# EAGLE schematic schematic (EAGLE 7.1.0)
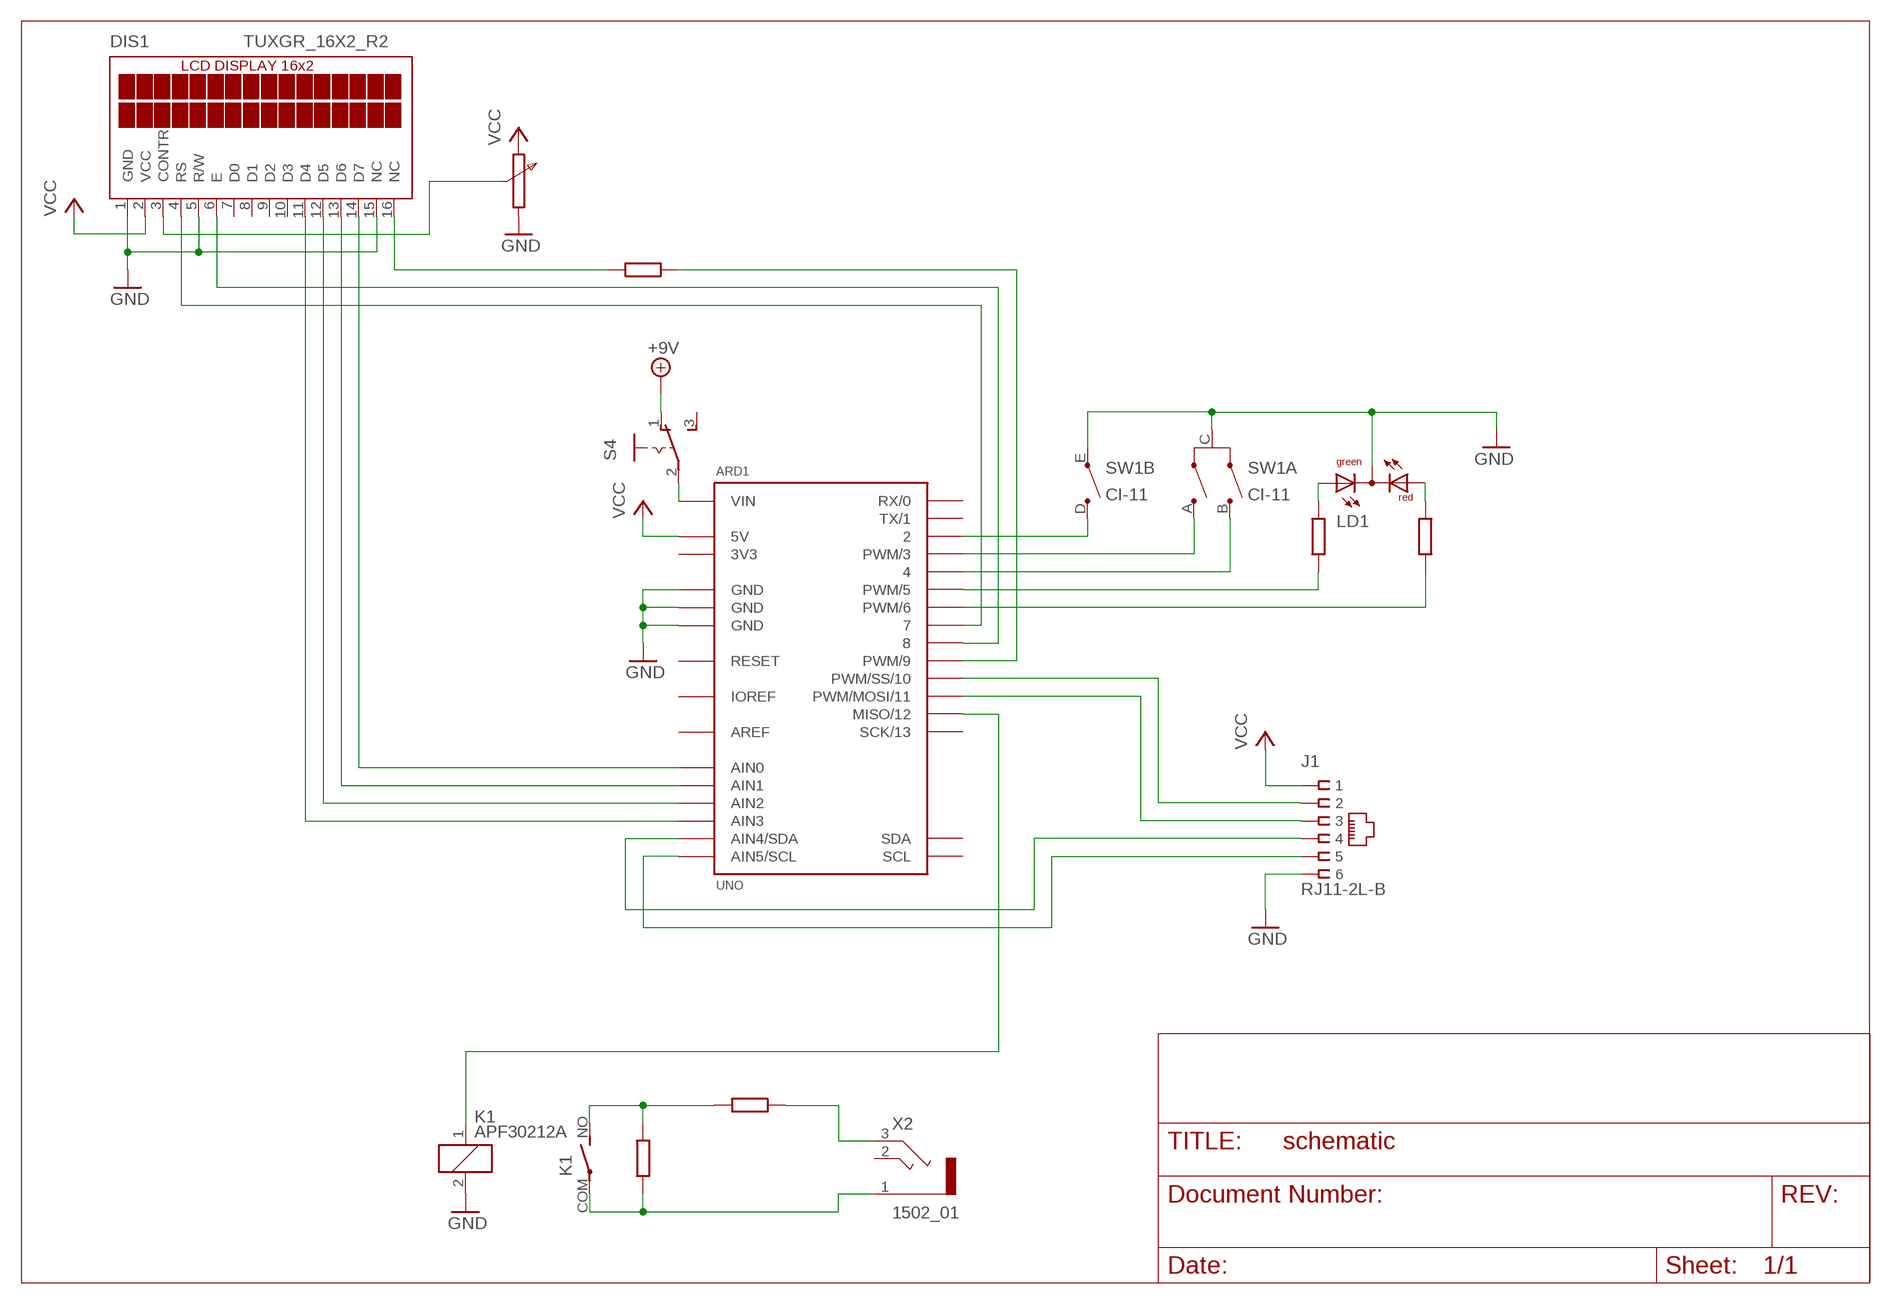
[diagram p0: schematic, sheet 1]

## Parts
ARD1  UNO  [UNO]
DIS1  TUXGR_16X2_R2  [TUXGR_16X2_R2]
J1  RJ11-2L-B  [RJ11-NO_SHIELD]
K1  APF30212A  [APF30212A]
LD1  DUOLED-RG-C  [DUOLED-C-5MM]
S4  M251  [M251]
SW1  CI-11  [CI-11]
X2  1502_01  [1502_01]

## Nets
+9V: S4.1(O)
GND: ARD1.GND@1(GND) ARD1.GND@2(GND) ARD1.GND@3(GND) DIS1.1(GND) DIS1.5(R/W) DIS1.15(NC) J1.6 K1.2 LD1.C SW1.C(A:C) SW1.E(B:E)
N$1: ARD1.7 DIS1.4(RS)
N$2: ARD1.8 DIS1.6(E)
N$3: ARD1.AIN0 DIS1.14(D7)
N$4: ARD1.AIN1 DIS1.13(D6)
N$5: ARD1.AIN2 DIS1.12(D5)
N$6: ARD1.AIN3 DIS1.11(D4)
N$7: DIS1.3(CONTR)
N$8: ARD1.2 SW1.D(B:D)
N$9: ARD1.3(PWM/3) SW1.A(A:A)
N$10: ARD1.4 SW1.B(A:B)
N$11: ARD1.5(PWM/5)
N$12: ARD1.6(PWM/6)
N$13: LD1.AX(AG)
N$14: LD1.AR
N$15: ARD1.VIN S4.2(P)
N$16: ARD1.12(MISO/12) K1.1
N$17: K1.NO(2:S)
N$18: K1.COM(2:P) X2.1
N$19: X2.3
N$20: DIS1.16(NC)
N$21: ARD1.9(PWM/9)
N$22: ARD1.10(PWM/SS/10) J1.2
N$23: ARD1.11(PWM/MOSI/11) J1.3
N$24: ARD1.AIN4(AIN4/SDA) J1.4
N$25: ARD1.AIN5(AIN5/SCL) J1.5
VCC: ARD1.5V DIS1.2(VCC) J1.1
Unconnected: ARD1.0(RX/0) ARD1.1(TX/1) ARD1.13(SCK/13) ARD1.RST(RESET) ARD1.SCL ARD1.SDA DIS1.7(D0) DIS1.8(D1) DIS1.9(D2) DIS1.10(D3) S4.3(S) X2.2

## Power pins joined to a net without a drawn wire
3V3: ARD1.3V3
AREF: ARD1.AREF
IOREF: ARD1.IOREF

## Library data of the parts
ARD1 = welectronic:UNO: Arduino UNO
DIS1 = display-lcd:TUXGR_16X2_R2: Tuxgraphics LCD display 16x2 characters reflective, without background light Source: tuxgr_12x2_r2.pdf; OC_FARNELL: unknown; OC_NEWARK: unknown
J1 = con-tycoelectronics:RJ11: CORCOM Modular RJ Jacks No Shield Source: www.tycoelectronics.com .. ENG_DS_1654001_1099_RJ_L_0507.pdf; MF: TYCO ELECTRONICS; MPN: RJ11-2L-B; OC_FARNELL: unknown; OC_NEWARK: 83F4463
K1 = relay:APF30212A: Compliant with European standards 1a/1c 6A Slim power relays Source: Data sheet <http://pewa.panasonic.com/assets/pcsd/catalog/pf-catalog.pdf>; OC_FARNELL: unknown
LD1 = led:DUOLED-RG-C: DUO LED 2 colors (red/green), 5 mm, round, common Cathode www.ligitek.com or other producers.
S4 = switch:M251: SLIDING SWITCH Mors, distributor Buerklin, 11G702
SW1 = piher:CI-11: 11mm Incemental Encoder Source: www.piher.net .. 04-CI-11v04.pdf; OC_FARNELL: unknown; OC_NEWARK: unknown
X2 = con-lumberg:1502_01: Jack connectors according to JISC 6560, 3.5 mm Klinkensteckverbinder nach JISC 6560, 3,5 mm Source: http://www.lumberg.com/Produkte/PDFs/1502_01.pdf; OC_FARNELL: 4739747; OC_NEWARK: unknown